# Altium project cdemu_ksm440.PrjPcb
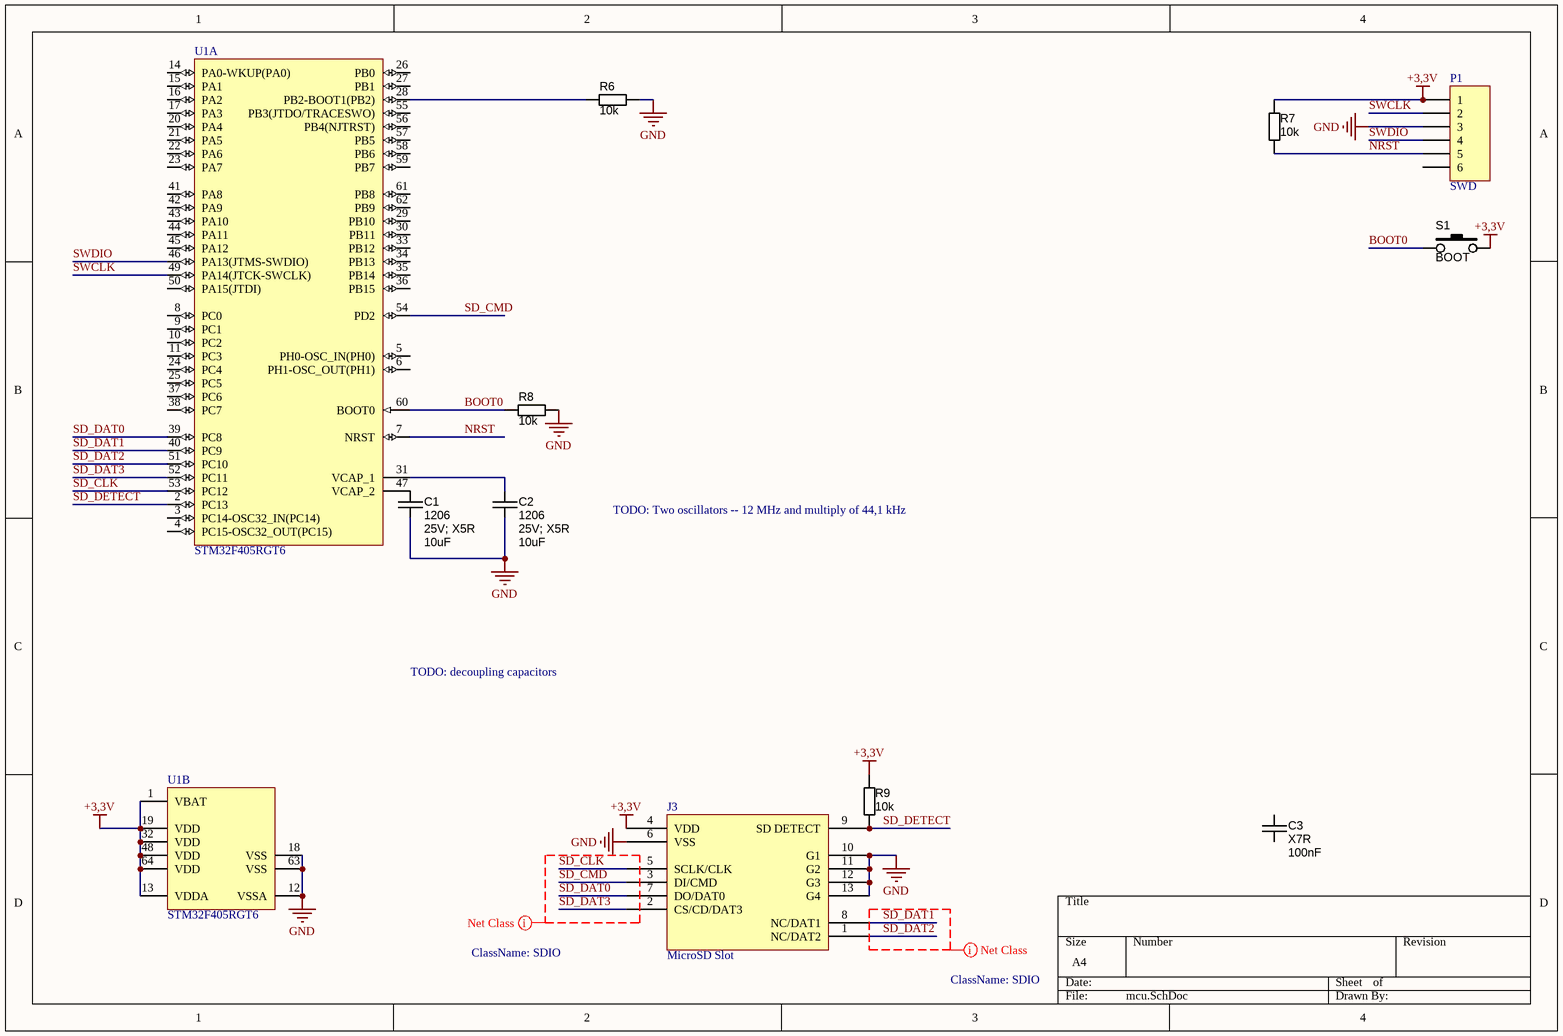
[diagram p0: mcu.SchDoc]
4 sheets, 59 parts. Net scope: flat (ports and power ports of the same name join across sheets).
Board file: cdemu_ksm440aem.PcbDoc
Sheets:
  mcu.SchDoc
  fpga.SchDoc
  cd_interface.SchDoc
  power_supply.SchDoc

## Sheet mcu.SchDoc
size A4

### Parts
C1  value 10uF  Package / Case: 1206  Ratings: 25V; X5R  [CAPC3216X180N]  (hidden comment: approved sub OK)
C2  value 10uF  Package / Case: 1206  Ratings: 25V; X5R  [CAPC3216X180N]  (hidden comment: approved sub OK)
C3  value 100nF  Temperature Coefficient: X7R  [CAPC2012X135N]  (hidden comment: 0805)
J3  MicroSD Slot  [MICROSD Slot]
P1  SWD  [HDR1X6]
R6  value 10k  [RESC2012N_ZERO]  (hidden comment: 0805)
R7  value 10k  [RESC2012N_ZERO]  (hidden comment: 0805)
R8  value 10k  [RESC2012N_ZERO]  (hidden comment: 0805)
R9  value 10k  [RESC2012N_ZERO]  (hidden comment: 0805)
S1  BOOT  [TACT-SWITCH-TC-37XB]
U1  STM32F405RGT6  [STM-LQFP64_M]  (parts A,B of 2)

### Nets
+3,3V: J3.4(VDD) P1.1 R7.1 R9.2 S1.2 U1.1(VBAT) U1.13(VDDA) U1.19(VDD) U1.32(VDD) U1.48(VDD) U1.64(VDD)
GND: C1.1 C2.1 J3.6(VSS) J3.10(G1) J3.11(G2) J3.12(G3) J3.13(G4) P1.3 R6.1 R8.1 U1.12(VSSA) U1.18(VSS) U1.63(VSS)
BOOT0: R8.2 S1.1 U1.60(BOOT0)
NRST: P1.5 R7.2 U1.7(NRST)
SD_CLK: J3.5(SCLK/CLK) U1.53(PC12)
SD_CMD: J3.3(DI/CMD) U1.54(PD2)
SD_DAT0: J3.7(DO/DAT0) U1.39(PC8)
SD_DAT1: J3.8(NC/DAT1) U1.40(PC9)
SD_DAT2: J3.1(NC/DAT2) U1.51(PC10)
SD_DAT3: J3.2(CS/CD/DAT3) U1.52(PC11)
SD_DETECT: J3.9(SD_DETECT) R9.1 U1.2(PC13)
SWCLK: P1.2 U1.49(PA14(JTCK-SWCLK))
SWDIO: P1.4 U1.46(PA13(JTMS-SWDIO))
NetC1_2: C1.2 U1.47(VCAP_2)
NetC2_2: C2.2 U1.31(VCAP_1)
NetR6_2: R6.2 U1.28(PB2-BOOT1(PB2))

Not connected (* = marked no-connect by the designer): C3 1 2; P1 6; U1 3(PC14-OSC32_IN(PC14)) 4(PC15-OSC32_OUT(PC15)) 5(PH0-OSC_IN(PH0)) 6(PH1-OSC_OUT(PH1)) 8(PC0) 9(PC1) 10(PC2) 11(PC3) 14(PA0-WKUP(PA0)) 15(PA1) 16(PA2) 17(PA3) 20(PA4) 21(PA5) 22(PA6) 23(PA7) 24(PC4) 25(PC5) 26(PB0) 27(PB1) 29(PB10) 30(PB11) 33(PB12) 34(PB13) 35(PB14) 36(PB15) 37(PC6) 38(PC7) 41(PA8) 42(PA9) 43(PA10) 44(PA11) 45(PA12) 50(PA15(JTDI)) 55(PB3(JTDO/TRACESWO)) 56(PB4(NJTRST)) 57(PB5) 58(PB6) 59(PB7) 61(PB8) 62(PB9)

### Layout directives
net class SDIO: SD_CLK, SD_CMD, SD_DAT0, SD_DAT1, SD_DAT2, SD_DAT3

### Notes on the sheet
- TODO: Two oscillators -- 12 MHz and multiply of 44,1 kHz
- TODO: decoupling capacitors

### Library data of the parts
C1 C2 = CAPC_10u_1206_16V: Capacitor SMD Cer 10uF 10% 16V X7R 1206; Manufacturer 1: Kemet; Manufacturer Part Number 1: C1206C106K4RACTU; Material: ceramic; SCDType: spec; Tolerance: ±10%; Supplier 1: Digi-Key; Supplier Part Number 1: 399-3525-1-ND
C3 = CAPC_1u_0805_X7R_16V_10%: Capacitor SMD Cer X7R 0805; Tolerance: ±10%; Ratings: 16V; X7R; Material: ceramic; SCDType: spec; Package / Case: 0805 (2012 metric)
P1 = Header 6: Header, 6-Pin; LatestRevisionDate: 17-Jul-2002; LatestRevisionNote: Re-released for DXP Platform.; Publisher: Altium Limited
R6-R9 = RES_0R_0805: Resistor SMD chip 0.0 Ohm 0.125W 0805; Manufacturer 1: Samsung Electro-Mechanics America, Inc; Manufacturer Part Number 1: RC2012J000CS; Ratings: 1/8W; SCDType: spec; Tolerance: N/A; Package / Case: 0805 (2012 metric); Supplier 1: Digi-Key; Supplier Part Number 1: 1276-5466-6-ND; RoHS 1: RoHS Compliant; ComponentLink1URL: http://www.samsungsem.com/servlet/FileDownload?filename=productcatalog/pdf/Chip_Resistor.pdf; ComponentLink1Description: http://www.samsungsem.com/servlet/FileDownload?filename=productcatalog/pdf/Chip_Resistor.pdf; Supplier 2: Digi-Key; Supplier Part Number 2: RMCF0805ZT0R00DKR-ND; Manufacturer 2: Stackpole Electronics Inc; Manufacturer Part Number 2: RMCF0805ZT0R00; RoHS 2: RoHS Compliant; ComponentLink2URL: http://www.seielect.com/Catalog/SEI-RMCF_RMCP.pdf; ComponentLink2Description: http://www.seielect.com/Catalog/SEI-RMCF_RMCP.pdf; Supplier 3: Digi-Key; Supplier Part Number 3: 311-0.0ARDKR-ND; Manufacturer 3: Yageo; Manufacturer Part Number 3: RC0805JR-070RL; RoHS 3: RoHS Compliant; ComponentLink3URL: http://media.digikey.com/pdf/Data%20Sheets/Yageo%20PDFs/RC0805%20Pb%20Free.pdf; ComponentLink3Description: http://media.digikey.com/pdf/Data%20Sheets/Yageo%20PDFs/RC0805%20Pb%20Free.pdf; Supplier 4: Digi-Key; Supplier Part Number 4: P0.0ADKR-ND; Manufacturer 4: Panasonic Electronic Components; Manufacturer Part Number 4: ERJ-6GEY0R00V; RoHS 4: RoHS Compliant; ComponentLink4URL: http://industrial.panasonic.com/www-cgi/jvcr13pz.cgi?E+PZ+3+AOA0001+ERJ6GEY0R00V+7+WW; ComponentLink4Description: http://industrial.panasonic.com/www-cgi/jvcr13pz.cgi?E+PZ+3+AOA0001+ERJ6GEY0R00V+7+WW; Supplier 5: Digi-Key; Supplier Part Number 5: RHM0.0CPDKR-ND; Manufacturer 5: Rohm Semiconductor; Manufacturer Part Number 5: MCR10ERTJ000; RoHS 5: RoHS Compliant; ComponentLink5URL: http://rohmfs.rohm.com/en/products/databook/datasheet/passive/resistor/chip_resistor/mcr_g.pdf; ComponentLink5Description: http://rohmfs.rohm.com/en/products/databook/datasheet/passive/resistor/chip_resistor/mcr_g.pdf
S1 = SW_THT_PB_5.0mm: Switch, tact, 5.0mm stem; Manufacturer 1: Wealth Metal; Manufacturer Part Number 1: TC-37XB; Function: On/Off; SCDType: spec; Package / Case: 6.5x6.5mm; 5.0mm stem; Material: Brass/Nylon/Ag plating
U1 = STM32F405RGT6: ARM Cortex-M4 32-bit MCU+FPU, 210 DMIPS, 1024 kB Flash, 192 kB Internal RAM, 51 I/Os, 64-pin LQFP, -40 to 85 degC, Tray; Manufacturer: STMicroelectronics; D/A Converter: 2x12-bit; FLASH Size (Prog) (kB): 1024; I/Os (High Current): 51; Internal RAM Size (kB): 192; Operating Frequency(F) (Processor speed) (MHz): 168; Supply Voltage(Vcc) max (V): 3.6; Supply Voltage(Vcc) min (V): 1.8; DatasheetVersion: Rev. 4; PackageVersion: Rev. 4, 06/2013; PackageReference: LQFP64; PackageDescription: 64-Pin Low Profile Quad Flat Package, 10 x 10 mm Body, 0.5 mm Pitch; Supplier 1: Digi-Key; Supplier Part Number 1: 497-11767-ND; Supplier 2: Farnell; Supplier Part Number 2: 2064363; Supplier 3: Newark; Supplier Part Number 3: 73T2329; Supplier 4: Mouser; Supplier Part Number 4: 511-STM32F405RGT6; Core: ARM Cortex-M4; Packing: Tray; Mounting Technology: Surface Mount; PartNumber: STM32F405RGT6; ComponentLink1Description: Manufacturer URL; ComponentLink1URL: http://www.st.com/web/en/home.html; ComponentLink2Description: Datasheet; ComponentLink2URL: http://www.st.com/st-web-ui/static/active/en/resource/technical/document/datasheet/DM00037051.pdf; ComponentLink3Description: Package Specification; ComponentLink3URL: http://www.st.com/st-web-ui/static/active/en/resource/technical/document/datasheet/DM00037051.pdf

## Sheet fpga.SchDoc
size A3
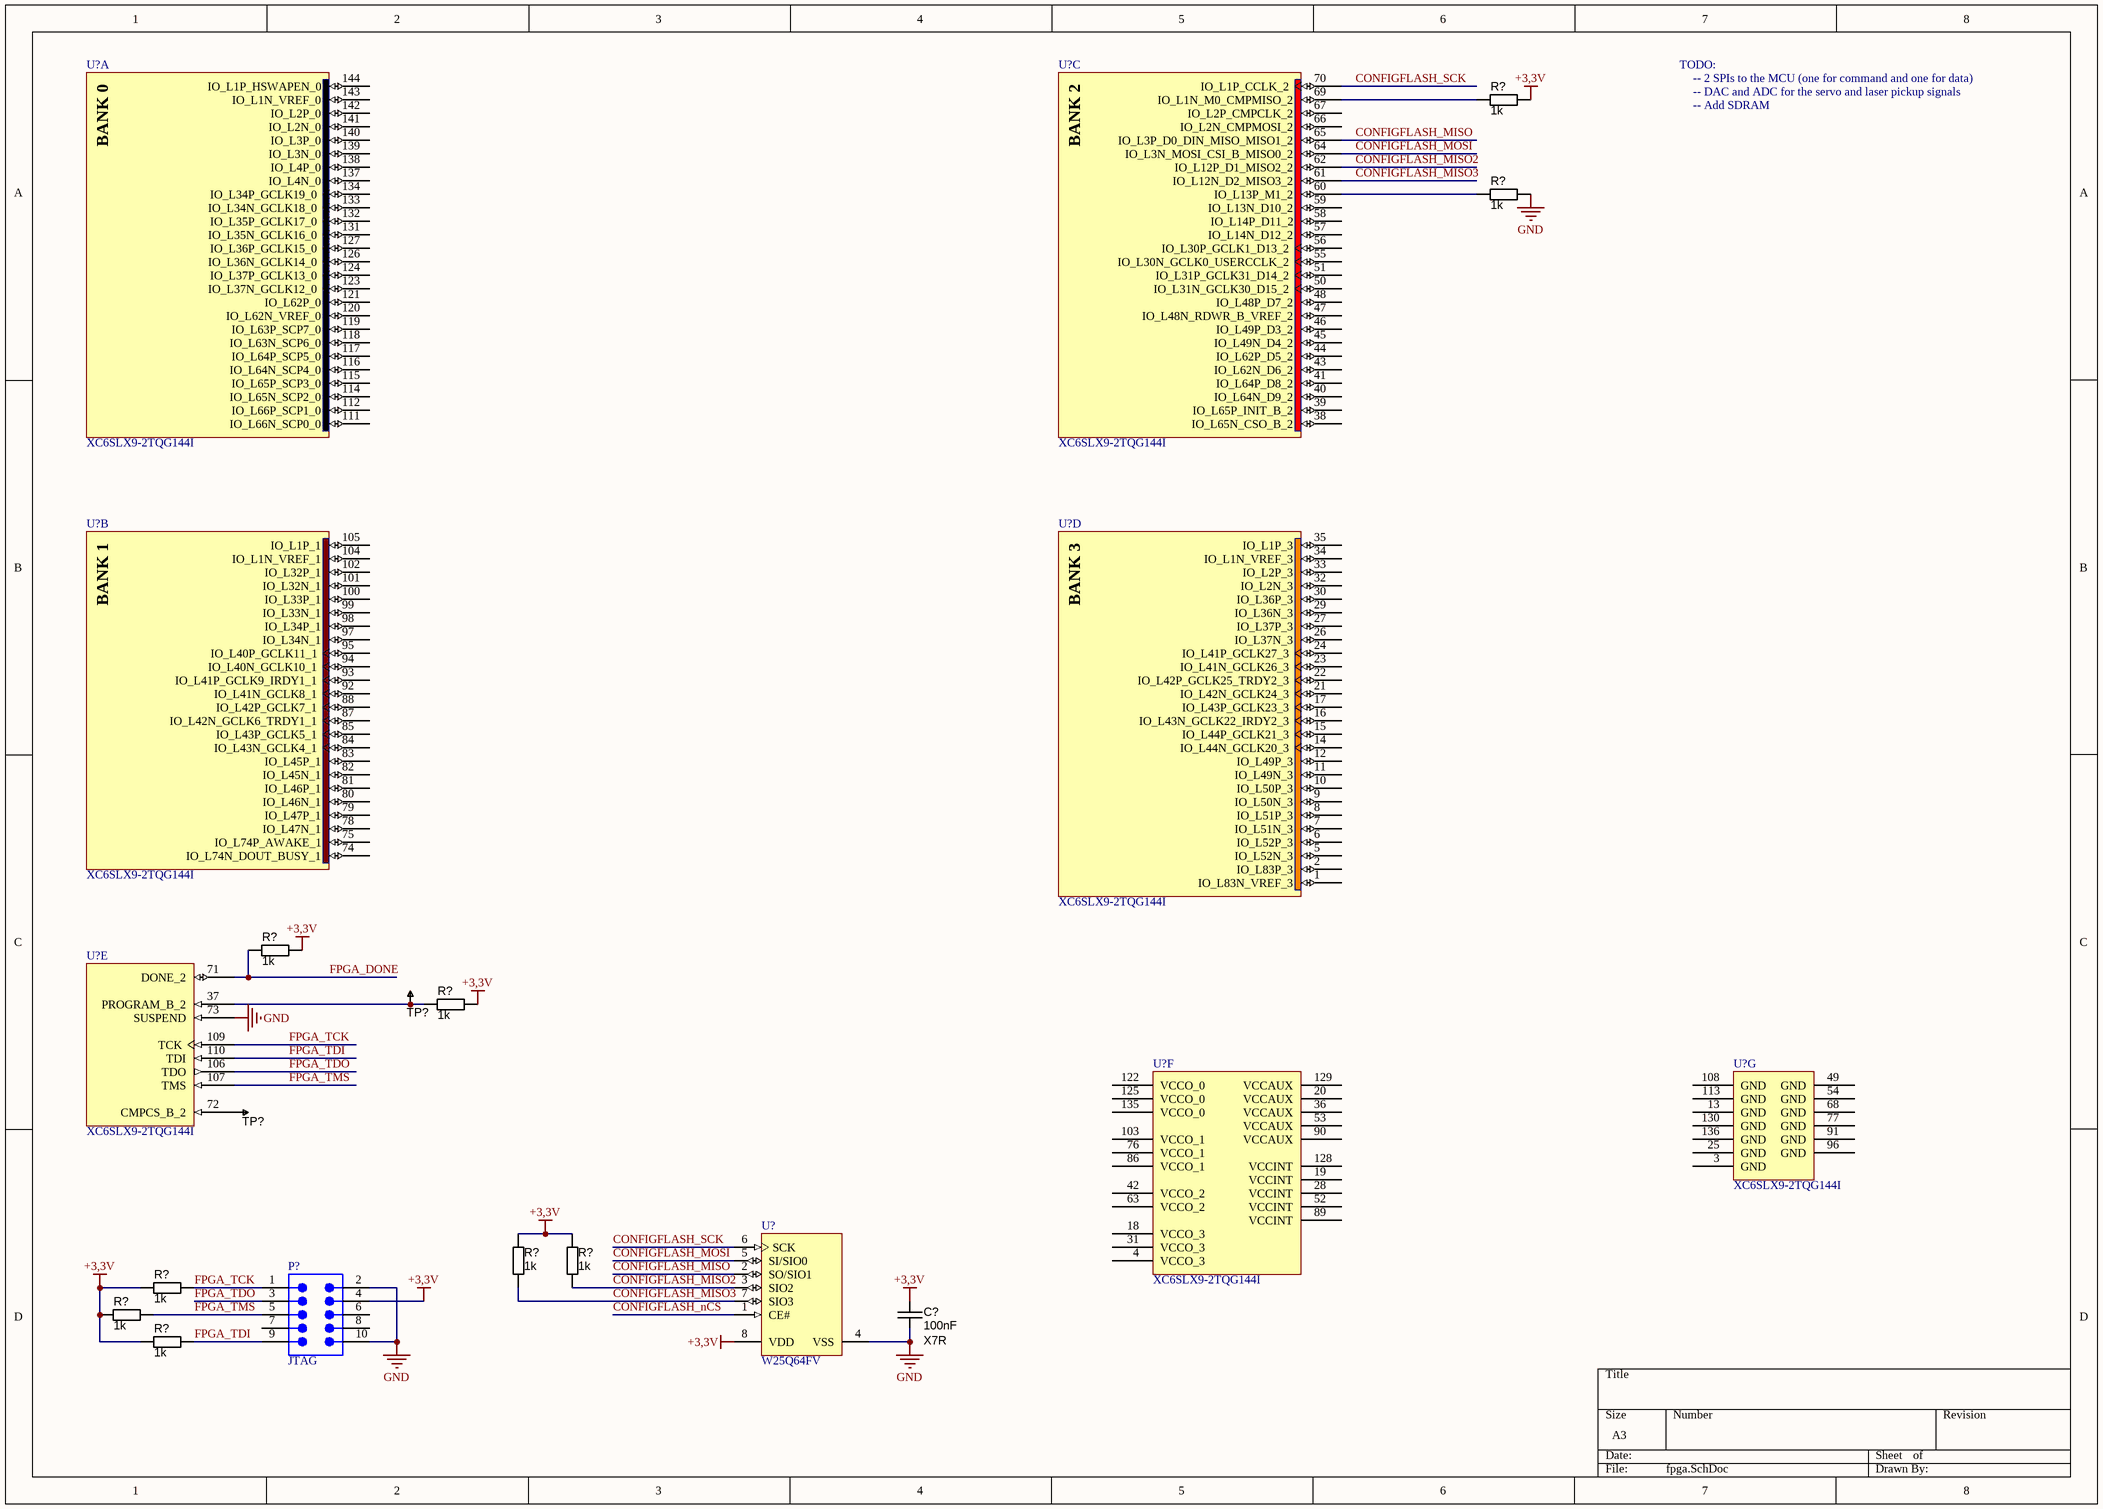
[diagram p1: fpga.SchDoc]

### Parts
(Parts that share a designator on the sheet are numbered #1, #2 ... from top to bottom, then left to right.)
C?#1  value 100nF  Temperature Coefficient: X7R  [CAPC2012X135N]  (hidden comment: 0805)
P?#1  JTAG  [918510x324]
R?#1  value 1k  [RESC2012N_ZERO]  (hidden comment: 0805)
R?#2  value 1k  [RESC2012N_ZERO]  (hidden comment: 0805)
R?#3  value 1k  [RESC2012N_ZERO]  (hidden comment: 0805)
R?#4  value 1k  [RESC2012N_ZERO]  (hidden comment: 0805)
R?#5  value 1k  [RESC2012N_ZERO]  (hidden comment: 0805)
R?#6  value 1k  [RESC2012N_ZERO]  (hidden comment: 0805)
R?#7  value 1k  [RESC2012N_ZERO]  (hidden comment: 0805)
R?#8  value 1k  [RESC2012N_ZERO]  (hidden comment: 0805)
R?#9  value 1k  [RESC2012N_ZERO]  (hidden comment: 0805)
TP?#1  TESTPOINT  [TP-R60]  (value not drawn)  (no BOM)
TP?#2  TESTPOINT  [TP-R60]  (value not drawn)  (no BOM)
U?#1  XC6SLX9-2TQG144I  [TQG144_M]  (part A of 7)
U?#2  XC6SLX9-2TQG144I  [TQG144_M]  (part C of 7)
U?#3  XC6SLX9-2TQG144I  [TQG144_M]  (part B of 7)
U?#4  XC6SLX9-2TQG144I  [TQG144_M]  (part D of 7)
U?#5  XC6SLX9-2TQG144I  [TQG144_M]  (part E of 7)
U?#6  XC6SLX9-2TQG144I  [TQG144_M]  (part F of 7)
U?#7  XC6SLX9-2TQG144I  [TQG144_M]  (part G of 7)
U?#8  W25Q64FV  [MCHP-SOIC-S2A8_M]

### Nets
+3,3V: C?#1.2 P?#1.4 R?#1.1 R?#3.1 R?#4.1 R?#5.2 R?#6.2 R?#7.1 R?#8.1 R?#9.1 U?#8.8(VDD)
GND: C?#1.1 P?#1.2 P?#1.10 R?#2.1 U?#5.73(SUSPEND) U?#8.4(VSS)
CONFIGFLASH_MISO: U?#2.65(IO_L3P_D0_DIN_MISO_MISO1_2) U?#8.2(SO/SIO1)
CONFIGFLASH_MISO2: R?#6.1 U?#2.62(IO_L12P_D1_MISO2_2) U?#8.3(SIO2)
CONFIGFLASH_MISO3: R?#5.1 U?#2.61(IO_L12N_D2_MISO3_2) U?#8.7(SIO3)
CONFIGFLASH_MOSI: U?#2.64(IO_L3N_MOSI_CSI_B_MISO0_2) U?#8.5(SI/SIO0)
CONFIGFLASH_nCS: U?#8.1(CE#)
CONFIGFLASH_SCK: U?#2.70(IO_L1P_CCLK_2) U?#8.6(SCK)
FPGA_DONE: R?#3.2 U?#5.71(DONE_2)
FPGA_TCK: P?#1.1 R?#7.2 U?#5.109(TCK)
FPGA_TDI: P?#1.9 R?#9.2 U?#5.110(TDI)
FPGA_TDO: P?#1.3 U?#5.106(TDO)
FPGA_TMS: P?#1.5 R?#8.2 U?#5.107(TMS)
NetR?#1_2: R?#1.2 U?#2.69(IO_L1N_M0_CMPMISO_2)
NetR?#2_2: R?#2.2 U?#2.60(IO_L13P_M1_2)
NetR?#4_2: R?#4.2 TP?#1.1 U?#5.37(PROGRAM_B_2)
NetTP?#2_1: TP?#2.1 U?#5.72(CMPCS_B_2)

Not connected (* = marked no-connect by the designer): P?#1 6 7 8; U?#1 111(IO_L66N_SCP0_0) 112(IO_L66P_SCP1_0) 114(IO_L65N_SCP2_0) 115(IO_L65P_SCP3_0) 116(IO_L64N_SCP4_0) 117(IO_L64P_SCP5_0) 118(IO_L63N_SCP6_0) 119(IO_L63P_SCP7_0) 120(IO_L62N_VREF_0) 121(IO_L62P_0) 123(IO_L37N_GCLK12_0) 124(IO_L37P_GCLK13_0) 126(IO_L36N_GCLK14_0) 127(IO_L36P_GCLK15_0) 131(IO_L35N_GCLK16_0) 132(IO_L35P_GCLK17_0) 133(IO_L34N_GCLK18_0) 134(IO_L34P_GCLK19_0) 137(IO_L4N_0) 138(IO_L4P_0) 139(IO_L3N_0) 140(IO_L3P_0) 141(IO_L2N_0) 142(IO_L2P_0) 143(IO_L1N_VREF_0) 144(IO_L1P_HSWAPEN_0); U?#2 38(IO_L65N_CSO_B_2) 39(IO_L65P_INIT_B_2) 40(IO_L64N_D9_2) 41(IO_L64P_D8_2) 43(IO_L62N_D6_2) 44(IO_L62P_D5_2) 45(IO_L49N_D4_2) 46(IO_L49P_D3_2) 47(IO_L48N_RDWR_B_VREF_2) 48(IO_L48P_D7_2) 50(IO_L31N_GCLK30_D15_2) 51(IO_L31P_GCLK31_D14_2) 55(IO_L30N_GCLK0_USERCCLK_2) 56(IO_L30P_GCLK1_D13_2) 57(IO_L14N_D12_2) 58(IO_L14P_D11_2) 59(IO_L13N_D10_2) 66(IO_L2N_CMPMOSI_2) 67(IO_L2P_CMPCLK_2); U?#3 74(IO_L74N_DOUT_BUSY_1) 75(IO_L74P_AWAKE_1) 78(IO_L47N_1) 79(IO_L47P_1) 80(IO_L46N_1) 81(IO_L46P_1) 82(IO_L45N_1) 83(IO_L45P_1) 84(IO_L43N_GCLK4_1) 85(IO_L43P_GCLK5_1) 87(IO_L42N_GCLK6_TRDY1_1) 88(IO_L42P_GCLK7_1) 92(IO_L41N_GCLK8_1) 93(IO_L41P_GCLK9_IRDY1_1) 94(IO_L40N_GCLK10_1) 95(IO_L40P_GCLK11_1) 97(IO_L34N_1) 98(IO_L34P_1) 99(IO_L33N_1) 100(IO_L33P_1) 101(IO_L32N_1) 102(IO_L32P_1) 104(IO_L1N_VREF_1) 105(IO_L1P_1); U?#4 1(IO_L83N_VREF_3) 2(IO_L83P_3) 5(IO_L52N_3) 6(IO_L52P_3) 7(IO_L51N_3) 8(IO_L51P_3) 9(IO_L50N_3) 10(IO_L50P_3) 11(IO_L49N_3) 12(IO_L49P_3) 14(IO_L44N_GCLK20_3) 15(IO_L44P_GCLK21_3) 16(IO_L43N_GCLK22_IRDY2_3) 17(IO_L43P_GCLK23_3) 21(IO_L42N_GCLK24_3) 22(IO_L42P_GCLK25_TRDY2_3) 23(IO_L41N_GCLK26_3) 24(IO_L41P_GCLK27_3) 26(IO_L37N_3) 27(IO_L37P_3) 29(IO_L36N_3) 30(IO_L36P_3) 32(IO_L2N_3) 33(IO_L2P_3) 34(IO_L1N_VREF_3) 35(IO_L1P_3); U?#6 4(VCCO_3) 18(VCCO_3) 19(VCCINT) 20(VCCAUX) 28(VCCINT) 31(VCCO_3) 36(VCCAUX) 42(VCCO_2) 52(VCCINT) 53(VCCAUX) 63(VCCO_2) 76(VCCO_1) 86(VCCO_1) 89(VCCINT) 90(VCCAUX) 103(VCCO_1) 122(VCCO_0) 125(VCCO_0) 128(VCCINT) 129(VCCAUX) 135(VCCO_0); U?#7 3(GND) 13(GND) 25(GND) 49(GND) 54(GND) 68(GND) 77(GND) 91(GND) 96(GND) 108(GND) 113(GND) 130(GND) 136(GND)

### Notes on the sheet
- TODO:
- -- Add SDRAM
- -- 2 SPIs to the MCU (one for command and one for data)
- -- DAC and ADC for the servo and laser pickup signals
- (in symbol XC6SLX9-2TQG144I, part A) BANK 0
- (in symbol XC6SLX9-2TQG144I, part B) BANK 1
- (in symbol XC6SLX9-2TQG144I, part C) BANK 2
- (in symbol XC6SLX9-2TQG144I, part D) BANK 3

### Library data of the parts
C?#1 = CAPC_1u_0805_X7R_16V_10%: as C3 on sheet mcu; Package / Case: 0805 (2012 metric)
P?#1 = 09 18 510 6324: Flat Cable Connector (IDC), Low-Profile Male Header, Straight Solder Pin, 10 Contacts, Performance Level 2; PCB_Layout: Complies with manufacturer's recommendation.; DrillSize: Corresponds to nominal value.; Published: 15-Nov-2004; DatasheetDocument: Sep-2003; PackageDocument: 03-Jun-2003; PackageReference: 918510x324; Publisher: Altium Limited; ComponentLink1Description: Manufacturer Link; ComponentLink1URL: http://www.harting.com/; ComponentLink2Description: Selection Guide; ComponentLink2URL: http://www.harting.com/imperia/md/content/steckverbinderundsystemkomponenten/folder/interface_engl_chapter_09.pdf
R?#1-R?#9 = RES_0R_0805: as R6 on sheet mcu; Tolerance: N/A; Package / Case: 0805 (2012 metric); Supplier 1: Digi-Key; Supplier Part Number 1: 1276-5466-6-ND; RoHS 1: RoHS Compliant; ComponentLink1URL: http://www.samsungsem.com/servlet/FileDownload?filename=productcatalog/pdf/Chip_Resistor.pdf; ComponentLink1Description: http://www.samsungsem.com/servlet/FileDownload?filename=productcatalog/pdf/Chip_Resistor.pdf; Supplier 2: Digi-Key; Supplier Part Number 2: RMCF0805ZT0R00DKR-ND; Manufacturer 2: Stackpole Electronics Inc; Manufacturer Part Number 2: RMCF0805ZT0R00; RoHS 2: RoHS Compliant; ComponentLink2URL: http://www.seielect.com/Catalog/SEI-RMCF_RMCP.pdf; ComponentLink2Description: http://www.seielect.com/Catalog/SEI-RMCF_RMCP.pdf; Supplier 3: Digi-Key; Supplier Part Number 3: 311-0.0ARDKR-ND; Manufacturer 3: Yageo; Manufacturer Part Number 3: RC0805JR-070RL; RoHS 3: RoHS Compliant; ComponentLink3URL: http://media.digikey.com/pdf/Data%20Sheets/Yageo%20PDFs/RC0805%20Pb%20Free.pdf; ComponentLink3Description: http://media.digikey.com/pdf/Data%20Sheets/Yageo%20PDFs/RC0805%20Pb%20Free.pdf; Supplier 4: Digi-Key; Supplier Part Number 4: P0.0ADKR-ND; Manufacturer 4: Panasonic Electronic Components; Manufacturer Part Number 4: ERJ-6GEY0R00V; RoHS 4: RoHS Compliant; ComponentLink4URL: http://industrial.panasonic.com/www-cgi/jvcr13pz.cgi?E+PZ+3+AOA0001+ERJ6GEY0R00V+7+WW; ComponentLink4Description: http://industrial.panasonic.com/www-cgi/jvcr13pz.cgi?E+PZ+3+AOA0001+ERJ6GEY0R00V+7+WW; Supplier 5: Digi-Key; Supplier Part Number 5: RHM0.0CPDKR-ND; Manufacturer 5: Rohm Semiconductor; Manufacturer Part Number 5: MCR10ERTJ000; RoHS 5: RoHS Compliant; ComponentLink5URL: http://rohmfs.rohm.com/en/products/databook/datasheet/passive/resistor/chip_resistor/mcr_g.pdf; ComponentLink5Description: http://rohmfs.rohm.com/en/products/databook/datasheet/passive/resistor/chip_resistor/mcr_g.pdf
TP?#1 TP?#2 = TESTPOINT: SMD test pin
U?#1-U?#7 = XC6SLX9-2TQG144I: Spartan-6 LX 1.2V FPGA, 102 User I/Os, 144-Pin TQFP (0.5mm Pitch), Speed Grade 2, Industrial Grade, Pb-Free; Published: 17-Nov-2009; DatasheetVersion: ver1.6, Nov-2010; PackageVersion: ver1.2, Jun-2004; PackageReference: TQG144; Publisher: Altium Limited; PackageDescription: 144-Pin Thin Quad Flat Pack (TQG144) - Pb-Free; Supplier 1: Digi-Key; Supplier Part Number 1: XC6SLX9-2TQG144I-ND; Code_JEDEC: MS-026-BFB; ComponentLink1Description: Manufacturer Link; ComponentLink1URL: http://www.xilinx.com; ComponentLink2Description: Spartan-6 Datasheet; ComponentLink2URL: http://www.xilinx.com/support/documentation/data_sheets/ds160.pdf; ComponentLink3Description: Spartan-6 Documents; ComponentLink3URL: http://www.xilinx.com/support/documentation/spartan-6.htm; ComponentLink4Description: Xilinx.com Home; ComponentLink4URL: http://www.xilinx.com
U?#8 = SST26VF032-80-5I-S2AE: 32 Mbit Serial Quad I/O (SQI) Flash Memory, 2.7 to 3.6 V, 80 MHz, -40 to 85 degC, 8-pin SOIC (S2A8), Tube; Manufacturer: Microchip; DatasheetVersion: Rev. A; PackageVersion: Rev. A; PackageReference: SOIC-S2A8; PackageDescription: 8-Lead Plastic Small Outline Intergrated Circuit, 5.275 x 5.275 mm Body, 1.27 mm Pitch; Supplier 1: Digi-Key; Supplier Part Number 1: SST26VF032-80-5I-S2AE-ND; Supplier 2: Newark; Supplier Part Number 2: 92R4616; Supplier 3: Mouser; Supplier Part Number 3: 579-26VF0328IS2AE; Mounting Technology: Surface Mount; PartNumber: SST26VF032-80-5I-S2AE; ComponentLink1Description: Manufacturer URL; ComponentLink1URL: http://www.microchip.com; ComponentLink2Description: Datasheet; ComponentLink2URL: http://ww1.microchip.com/downloads/en/DeviceDoc/25017A.pdf; ComponentLink3Description: Package Specification; ComponentLink3URL: http://ww1.microchip.com/downloads/en/DeviceDoc/25051A.pdf; ComponentLink4Description: Product URL; ComponentLink4URL: http://www.microchip.com/SST26VF032

## Sheet cd_interface.SchDoc
size A4
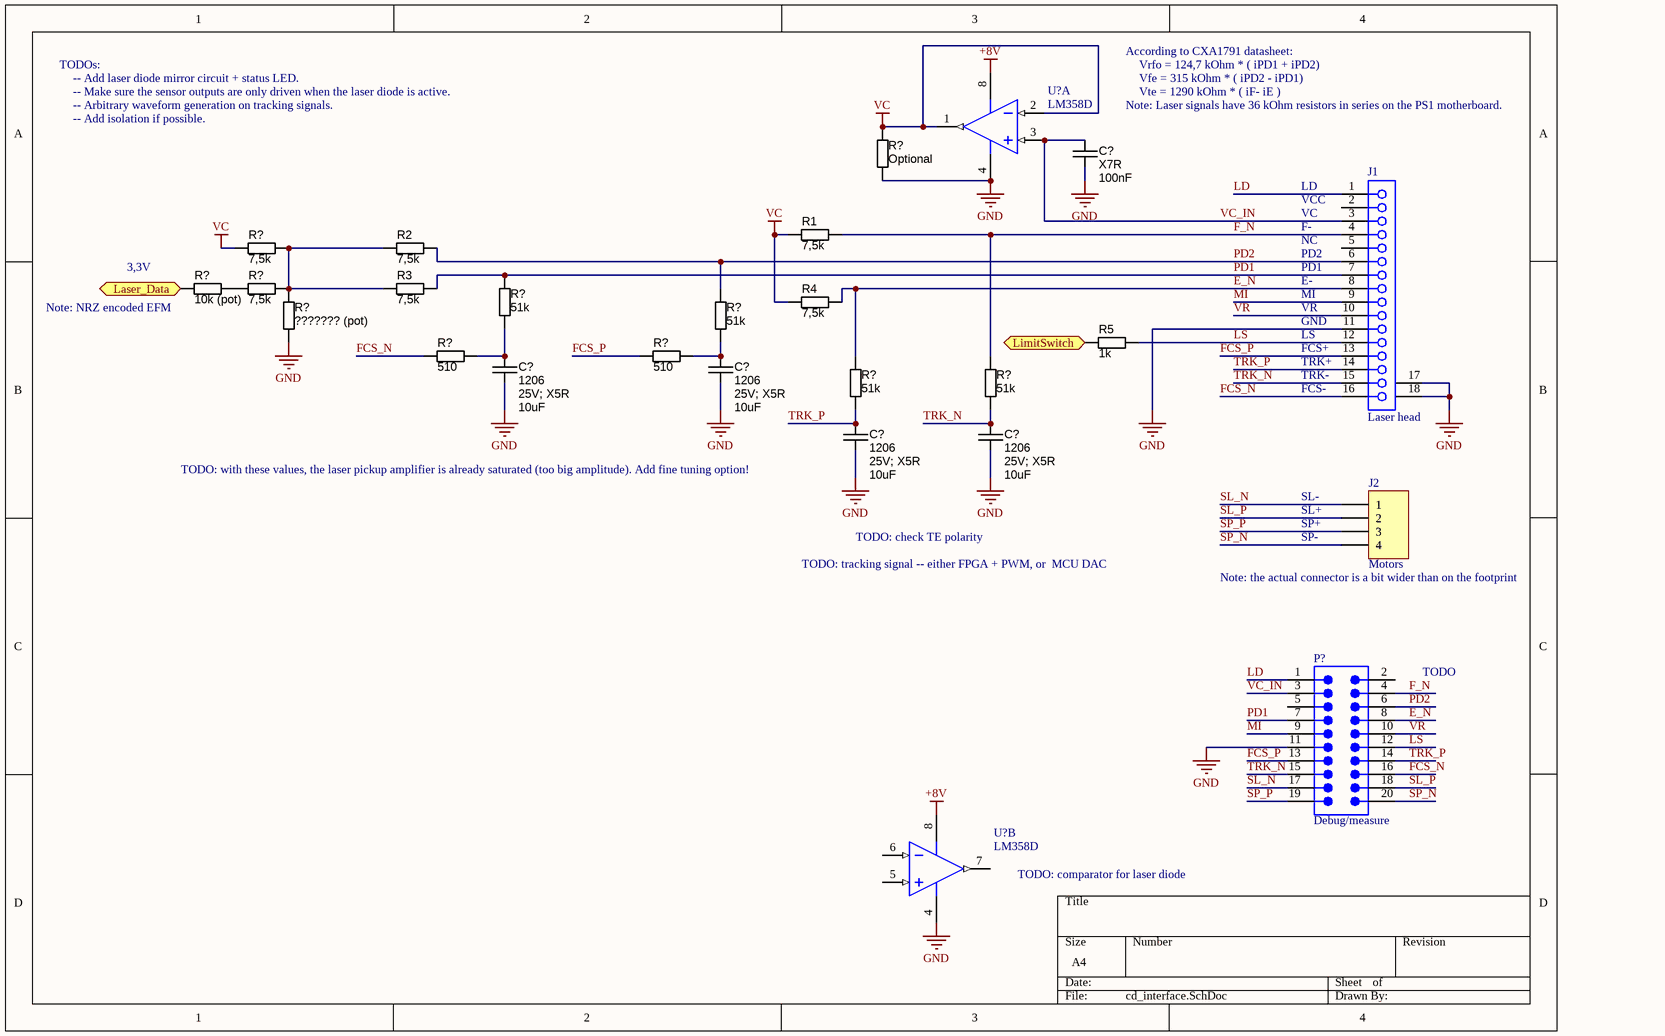
[diagram p2: cd_interface.SchDoc]

### Parts
(Parts that share a designator on the sheet are numbered #1, #2 ... from top to bottom, then left to right.)
C?#2  value 100nF  Temperature Coefficient: X7R  [CAPC2012X135N]  (hidden comment: 0805)
C?#3  value 10uF  Package / Case: 1206  Ratings: 25V; X5R  [CAPC3216X180N]  (hidden comment: approved sub OK)
C?#4  value 10uF  Package / Case: 1206  Ratings: 25V; X5R  [CAPC3216X180N]  (hidden comment: approved sub OK)
C?#5  value 10uF  Package / Case: 1206  Ratings: 25V; X5R  [CAPC3216X180N]  (hidden comment: approved sub OK)
C?#6  value 10uF  Package / Case: 1206  Ratings: 25V; X5R  [CAPC3216X180N]  (hidden comment: approved sub OK)
J1  Laser head  [FPC16_1mm_top]
J2  Motors  [64800411622]
P?#2  Debug/measure  [918520x329]
R1  value 7,5k  [RESC2012N_ZERO]  (hidden comment: 0805)
R2  value 7,5k  [RESC2012N_ZERO]  (hidden comment: 0805)
R3  value 7,5k  [RESC2012N_ZERO]  (hidden comment: 0805)
R4  value 7,5k  [RESC2012N_ZERO]  (hidden comment: 0805)
R5  value 1k  [RESC2012N_ZERO]  (hidden comment: 0805)
R?#10  value Optional  [RESC2012N_ZERO]  (hidden comment: 0805)
R?#11  value 7,5k  [RESC2012N_ZERO]  (hidden comment: 0805)
R?#12  value 10k (pot)  [RESC2012N_ZERO]  (hidden comment: 0805)
R?#13  value 7,5k  [RESC2012N_ZERO]  (hidden comment: 0805)
R?#14  value 51k  [RESC2012N_ZERO]  (hidden comment: 0805)
R?#15  value ??????? (pot)  [RESC2012N_ZERO]  (hidden comment: 0805)
R?#16  value 51k  [RESC2012N_ZERO]  (hidden comment: 0805)
R?#17  value 510  [RESC2012N_ZERO]  (hidden comment: 0805)
R?#18  value 510  [RESC2012N_ZERO]  (hidden comment: 0805)
R?#19  value 51k  [RESC2012N_ZERO]  (hidden comment: 0805)
R?#20  value 51k  [RESC2012N_ZERO]  (hidden comment: 0805)
U?#9  LM358D  [751-07_M]  (part A of 2)
U?#10  LM358D  [751-07_M]  (part B of 2)

### Ports
Laser_Data (in), LimitSwitch (in)

### Nets
+8V: U?#9.8(V+) U?#10.8(V+)
GND: C?#2.2 C?#3.1 C?#4.1 C?#5.1 C?#6.1 J1.11 J1.17(MH1) J1.18(MH2) P?#2.11 R?#10.1 R?#15.1 U?#9.4(V-) U?#10.4(V-)
VC: R1.1 R4.1 R?#10.2 R?#11.1 U?#9.1(OUT) U?#9.2(IN-)
E_N: J1.8 P?#2.8 R4.2 R?#19.2
F_N: J1.4 P?#2.4 R1.2 R?#20.2
FCS_N: J1.16 P?#2.16 R?#17.1
FCS_P: J1.13 P?#2.13 R?#18.1
LD: J1.1 P?#2.1
LS: J1.12 P?#2.12 R5.2
MI: J1.9 P?#2.9
PD1: J1.7 P?#2.7 R3.2 R?#14.2
PD2: J1.6 P?#2.6 R2.2 R?#16.2
SL_N: J2.1 P?#2.17
SL_P: J2.2 P?#2.18
SP_N: J2.4 P?#2.20
SP_P: J2.3 P?#2.19
TRK_N: C?#6.2 J1.15 P?#2.15 R?#20.1
TRK_P: C?#5.2 J1.14 P?#2.14 R?#19.1
VC_IN: C?#2.1 J1.3 P?#2.3 U?#9.3(IN+)
VR: J1.10 P?#2.10
NetC?#3_2: C?#3.2 R?#14.1 R?#17.2
NetC?#4_2: C?#4.2 R?#16.1 R?#18.2
NetR2_1: R2.1 R3.1 R?#11.2 R?#13.2 R?#15.2
NetR5_1: R5.1 ; port LimitSwitch
NetR?#12_1: R?#12.1 ; port Laser_Data
NetR?#12_2: R?#12.2 R?#13.1

Not connected (* = marked no-connect by the designer): J1 2 5; P?#2 2 5; U?#10 5(IN+) 6(IN-) 7(OUT)

### Notes on the sheet
- TODOs:
- -- Add laser diode mirror circuit + status LED.
- -- Make sure the sensor outputs are only driven when the laser diode is active.
- -- Arbitrary waveform generation on tracking signals.
- According to CXA1791 datasheet:
- Note: Laser signals have 36 kOhm resistors in series on the PS1 motherboard.
- Vrfo = 124,7 kOhm * ( iPD1 + iPD2)
- Vfe = 315 kOhm * ( iPD2 - iPD1)
- Vte = 1290 kOhm * ( iF- iE )
- -- Add isolation if possible.
- LD
- (near J1) VCC
- VC
- F-
- NC
- (near R?#12) Note: NRZ encoded EFM
- (near R?#12) 3,3V
- (near J1) PD2
- (near J1) PD1
- E-
- MI
- VR
- (near J1) GND
- LS
- (near J1) FCS+
- (near J1) TRK+
- (near J1) TRK-
- (near J1) FCS-
- (near C?#5) TODO: with these values, the laser pickup amplifier is already saturated (too big amplitude). Add fine tuning option!
- (near J2) SL-
- (near J2) SL+
- TODO: tracking signal -- either FPGA + PWM, or  MCU DAC
- TODO: check TE polarity
- (near J2) Note: the actual connector is a bit wider than on the footprint
- (near J2) SP+
- (near J2) SP-
- TODO
- TODO: comparator for laser diode

### Library data of the parts
C?#2 = CAPC_1u_0805_X7R_16V_10%: as C3 on sheet mcu; Package / Case: 0805 (2012 metric)
C?#3-C?#6 = CAPC_10u_1206_16V: as C1 on sheet mcu; Tolerance: ±10%; Supplier 1: Digi-Key; Supplier Part Number 1: 399-3525-1-ND
J1 = CL586-0536-8: FH12 Series, "Flip-Lock" SMT/ZIF FFC/FPC Connector - 1.0mm Spaced Bottom Standard Contact; Positions: 16; ContactMaterial: Phosphor Bronze; Current: 0.5A; PCB_Layout: Complies with manufacturer's recommendation.; Note: Pad dimensions follow nominal values, Suitable for Wave Soldering, Adjust for Re-flow.; Published: 17-Jul-2002; DatasheetVersion: 13-Nov-2000; PackageVersion: 13-Nov-2000; PackageReference: FH12-16S-1SH; Publisher: Altium Limited; ComponentLink1Description: Manufacturer Link; ComponentLink1URL: http://www.hiroseusa.com/; ComponentLink2Description: Datasheet; ComponentLink2URL: http://www.hirose.co.jp/cataloge_hp/e58605370.pdf
J2 = WE-1.50mm Pitch 64800411622: WR-WTB 1.50mm Male Shrouded Header; Manufacturer: W¨¹rth Elektronik eiSos GmbH; ComponentLink1 Description: Manufacturer; ComponentLink2 Description: Datasheet; NoPins: 4; Created Date: 11 June 2013; partNo: 64800411622; ComponentLink1URL: http://www.we-online.com; ComponentLink2URL: http://katalog.we-online.de/em/datasheet/6480xx11622.pdf; Created by: Karrer Zheng
P?#2 = 09 18 520 6329: Flat Cable Connector (IDC), Standard Male Header, Straight Press-in Pin, 20 Contacts, Performance Level 2; PCB_Layout: Complies with manufacturer's recommendation.; DrillSize: Corresponds to nominal value.; Published: 15-Nov-2004; PackageDocument: Feb-2000; PackageReference: 918520x329; Publisher: Altium Limited; ComponentLink1Description: Manufacturer Link; ComponentLink1URL: http://www.harting.com/; ComponentLink2Description: Packaging Specification; ComponentLink2URL: http://www.harkis.harting.com/_sek/pdf/TB_0918520x329_BL01_R32154.pdf
R1-R5 R?#10-R?#20 = RES_0R_0805: as R6 on sheet mcu; Tolerance: N/A; Package / Case: 0805 (2012 metric); Supplier 1: Digi-Key; Supplier Part Number 1: 1276-5466-6-ND; RoHS 1: RoHS Compliant; ComponentLink1URL: http://www.samsungsem.com/servlet/FileDownload?filename=productcatalog/pdf/Chip_Resistor.pdf; ComponentLink1Description: http://www.samsungsem.com/servlet/FileDownload?filename=productcatalog/pdf/Chip_Resistor.pdf; Supplier 2: Digi-Key; Supplier Part Number 2: RMCF0805ZT0R00DKR-ND; Manufacturer 2: Stackpole Electronics Inc; Manufacturer Part Number 2: RMCF0805ZT0R00; RoHS 2: RoHS Compliant; ComponentLink2URL: http://www.seielect.com/Catalog/SEI-RMCF_RMCP.pdf; ComponentLink2Description: http://www.seielect.com/Catalog/SEI-RMCF_RMCP.pdf; Supplier 3: Digi-Key; Supplier Part Number 3: 311-0.0ARDKR-ND; Manufacturer 3: Yageo; Manufacturer Part Number 3: RC0805JR-070RL; RoHS 3: RoHS Compliant; ComponentLink3URL: http://media.digikey.com/pdf/Data%20Sheets/Yageo%20PDFs/RC0805%20Pb%20Free.pdf; ComponentLink3Description: http://media.digikey.com/pdf/Data%20Sheets/Yageo%20PDFs/RC0805%20Pb%20Free.pdf; Supplier 4: Digi-Key; Supplier Part Number 4: P0.0ADKR-ND; Manufacturer 4: Panasonic Electronic Components; Manufacturer Part Number 4: ERJ-6GEY0R00V; RoHS 4: RoHS Compliant; ComponentLink4URL: http://industrial.panasonic.com/www-cgi/jvcr13pz.cgi?E+PZ+3+AOA0001+ERJ6GEY0R00V+7+WW; ComponentLink4Description: http://industrial.panasonic.com/www-cgi/jvcr13pz.cgi?E+PZ+3+AOA0001+ERJ6GEY0R00V+7+WW; Supplier 5: Digi-Key; Supplier Part Number 5: RHM0.0CPDKR-ND; Manufacturer 5: Rohm Semiconductor; Manufacturer Part Number 5: MCR10ERTJ000; RoHS 5: RoHS Compliant; ComponentLink5URL: http://rohmfs.rohm.com/en/products/databook/datasheet/passive/resistor/chip_resistor/mcr_g.pdf; ComponentLink5Description: http://rohmfs.rohm.com/en/products/databook/datasheet/passive/resistor/chip_resistor/mcr_g.pdf
U?#9 U?#10 = LM358D: Single-Supply Dual Operational Amplifier; Published: 28-Feb-2003; LatestRevisionDate: 13-Apr-2006; LatestRevisionNote: IPC-7351 Footprint Added.; DatasheetVersion: Jan-2002, Rev. 7; PackageVersion: rev7, Jan-2002; PackageReference: 751-07; Publisher: Altium Limited; PackageDescription: 8-Pin Plastic Small Outline Integrated Circuit 1.27 mm Pitch; Code_JEDEC: MS-012-AA; Code_IPC: SOIC127P600-8; ComponentLink1Description: Manufacturer Link; ComponentLink1URL: http://www.onsemi.com/; ComponentLink2Description: Datasheet; ComponentLink2URL: http://www.onsemi.com/pub/Collateral/LM358-D.PDF

## Sheet power_supply.SchDoc
size A4
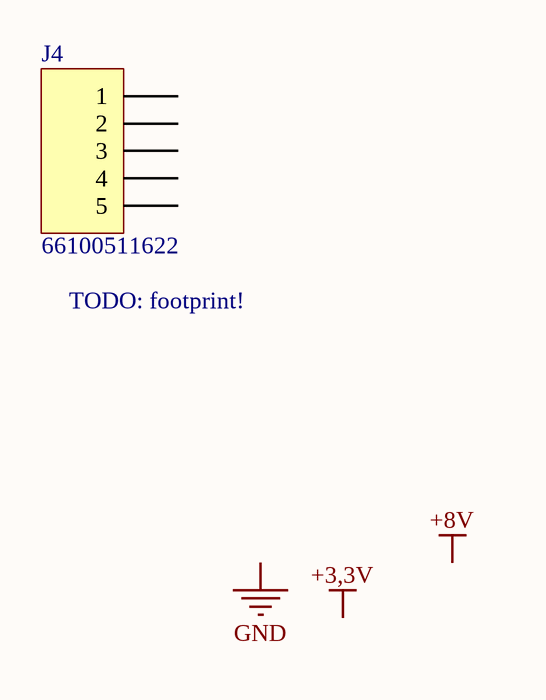
[diagram p3: power_supply.SchDoc]

### Parts
J4  66100511622  [66100511622]

### Nets

Not connected (* = marked no-connect by the designer): J4 1 2 3 4 5

### Notes on the sheet
- (near J4) TODO: footprint!
- Labels drawn without touching a wire or pin: +3,3V, +8V, GND

### Library data of the parts
J4 = WE-2.54 mm Pitch 66100511622: WR-WTB 2.54mm Shrouded Header_Straight; Manufacturer: Wurth Elektronik; ComponentLink1 Description: Manufacturer; ComponentLink2 Description: Datasheet; NoPins: 5; Created Date: 21.Sep.2015; partNo: 66100511622; ComponentLink1URL: http://www.we-online.com; Created by: Baojun Chen

## Nets that join several sheets
+3,3V: mcu (11 pins), fpga (11 pins)
GND: mcu (13 pins), fpga (6 pins), cd_interface (13 pins)